# Altium schematic sheet Bypass_FPGA_1V2.SCHDOC: FPGA Bypass Capacitors for 1V2
size A4; Organization: Altium Limited.; Address1: Level 3, 12a Rodborough Rd; Address2: Frenchs Forest 2086; Address3: NSW; Address4: AUSTRALIA; DocumentNumber: 5; SheetNumber: 5; SheetTotal: 21
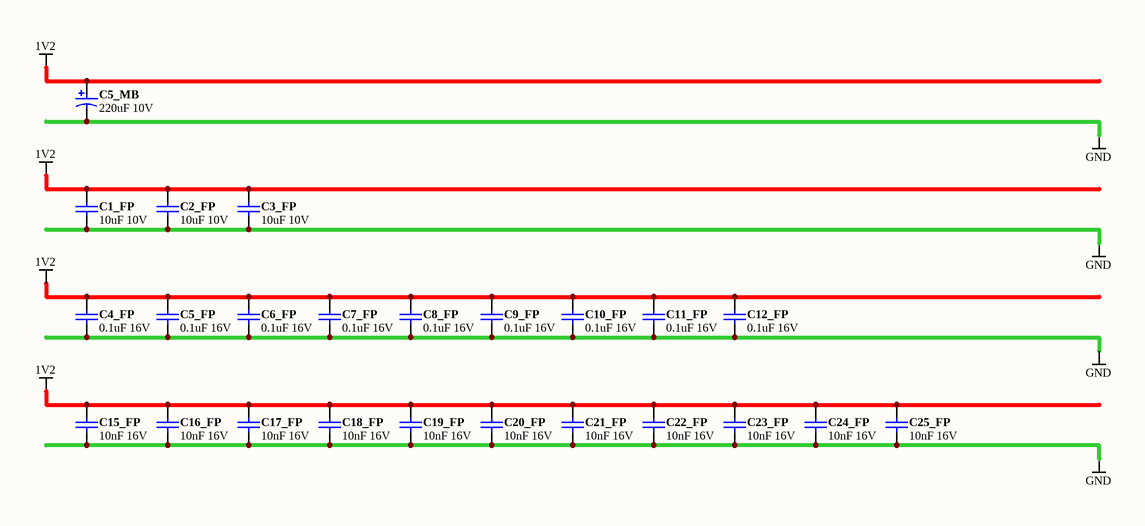
[diagram p0: Bypass_FPGA_1V2.SCHDOC]

## Parts
C1_FP  10uF 10V  [CAPC2012-STAR]
C2_FP  10uF 10V  [CAPC2012-STAR]
C3_FP  10uF 10V  [CAPC2012-STAR]
C4_FP  0.1uF 16V  [CAPC1005-STAR]
C5_FP  0.1uF 16V  [CAPC1005-STAR]
C5_MB  220uF 10V  [CAPC7343-STAR]
C6_FP  0.1uF 16V  [CAPC1005-STAR]
C7_FP  0.1uF 16V  [CAPC1005-STAR]
C8_FP  0.1uF 16V  [CAPC1005-STAR]
C9_FP  0.1uF 16V  [CAPC1005-STAR]
C10_FP  0.1uF 16V  [CAPC1005-STAR]
C11_FP  0.1uF 16V  [CAPC1005-STAR]
C12_FP  0.1uF 16V  [CAPC1005-STAR]
C15_FP  10nF 16V  [CAPC1005-STAR]
C16_FP  10nF 16V  [CAPC1005-STAR]
C17_FP  10nF 16V  [CAPC1005-STAR]
C18_FP  10nF 16V  [CAPC1005-STAR]
C19_FP  10nF 16V  [CAPC1005-STAR]
C20_FP  10nF 16V  [CAPC1005-STAR]
C21_FP  10nF 16V  [CAPC1005-STAR]
C22_FP  10nF 16V  [CAPC1005-STAR]
C23_FP  10nF 16V  [CAPC1005-STAR]
C24_FP  10nF 16V  [CAPC1005-STAR]
C25_FP  10nF 16V  [CAPC1005-STAR]

## Nets
1V2: C1_FP.1 C2_FP.1 C3_FP.1 C4_FP.1 C5_FP.1 C5_MB.1 C6_FP.1 C7_FP.1 C8_FP.1 C9_FP.1 C10_FP.1 C11_FP.1 C12_FP.1 C15_FP.1 C16_FP.1 C17_FP.1 C18_FP.1 C19_FP.1 C20_FP.1 C21_FP.1 C22_FP.1 C23_FP.1 C24_FP.1 C25_FP.1
GND: C1_FP.2 C2_FP.2 C3_FP.2 C4_FP.2 C5_FP.2 C5_MB.2 C6_FP.2 C7_FP.2 C8_FP.2 C9_FP.2 C10_FP.2 C11_FP.2 C12_FP.2 C15_FP.2 C16_FP.2 C17_FP.2 C18_FP.2 C19_FP.2 C20_FP.2 C21_FP.2 C22_FP.2 C23_FP.2 C24_FP.2 C25_FP.2

## Notes on the sheet
- Sheet Title
- Project Title
- Size:
- Date:
- A4
- Assy:
- Time:
- Revision:
- Sheet
- of
- File:

## Library data of the parts
C1_FP C2_FP C3_FP = D-101-0087: Capacitor, Ceramic, 10uF 10% 10V 0805 (2012) X5R; Polarity: Non-Polarized; Capacitance: 10 uF; Dielectric: X5R; Mounting Technology: Surface Mount; Rated Voltage: 10 V; Status: Unreleased; Technology: None; Tolerance: 10 %; Category: Capacitor
C4_FP C5_FP C6_FP C7_FP C8_FP C9_FP C10_FP C11_FP C12_FP = D-101-0080: Capacitor, Ceramic, 0.1uF 10% 16V 0402 (1005) X7R; Polarity: Non-Polarized; Capacitance: 0.1 uF; Dielectric: X7R; Mounting Technology: Surface Mount; Rated Voltage: 16 V; Status: Production; Technology: Ceramic; Tolerance: 10 %; Category: Capacitor
C5_MB = D-101-0088: Capacitor, Tantalum, 220uF 10% 10V MCCT-D (7343-31); Polarity: Polarized; Capacitance: 220 uF; Mounting Technology: Surface Mount; Rated Voltage: 10 V; Status: Unreleased; Technology: Tantalum; Tolerance: 10 %; Category: Capacitor
C15_FP C16_FP C17_FP C18_FP C19_FP C20_FP C21_FP C22_FP C23_FP C24_FP C25_FP = D-101-0077: Capacitor, Ceramic, 10nF 10% 16V 0402 (1005) X7R; Polarity: Non-Polarized; Capacitance: 10 nF; Dielectric: X7R; Mounting Technology: Surface Mount; Rated Voltage: 16 V; Status: Production; Technology: Ceramic; Tolerance: 10 %; Category: Capacitor